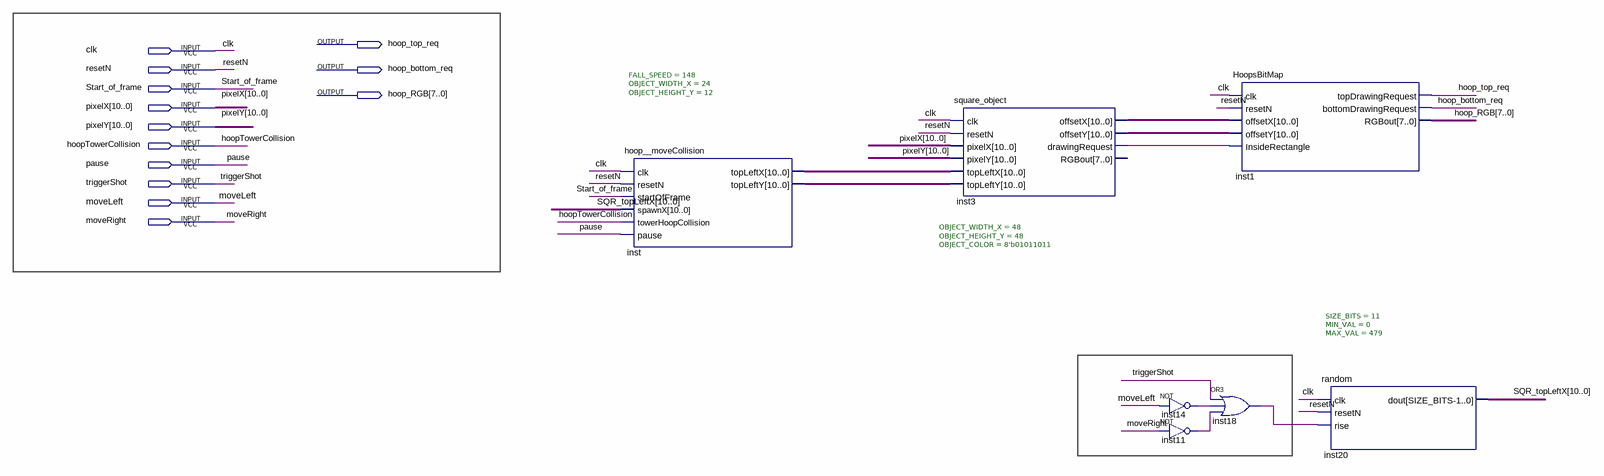
[diagram p0: schematic sheet]
// Quartus schematic TOP_HOOP.bdf as structural Verilog: 7 symbols, 13 pins
module TOP_HOOP (
  input  clk,
  input  resetN,
  input  Start_of_frame,
  input  [10:0] pixelX,
  input  [10:0] pixelY,
  input  hoopTowerCollision,
  input  pause,
  input  triggerShot,
  input  moveLeft,
  input  moveRight,
  output hoop_top_req,
  output hoop_bottom_req,
  output [7:0] hoop_RGB
);

  wire inst3_drawingrequest, inst11_out, inst14_out, inst18_out;
  wire [10:0] inst3_offsetx, inst3_offsety, inst_topleftx, inst_toplefty, SQR_topLeftX;

  hoop__moveCollision #(.FALL_SPEED(148), .OBJECT_WIDTH_X(24), .OBJECT_HEIGHT_Y(12)) inst (
    .clk(clk), .resetN(resetN), .startOfFrame(Start_of_frame), .spawnX(SQR_topLeftX),
    .towerHoopCollision(hoopTowerCollision), .pause(pause), .topLeftX(inst_topleftx), .topLeftY(inst_toplefty));
  square_object #(.OBJECT_WIDTH_X(48), .OBJECT_HEIGHT_Y(48), .OBJECT_COLOR(8'b01011011)) inst3 (
    .clk(clk), .resetN(resetN), .pixelX(pixelX), .pixelY(pixelY), .topLeftX(inst_topleftx),
    .topLeftY(inst_toplefty), .offsetX(inst3_offsetx), .offsetY(inst3_offsety),
    .drawingRequest(inst3_drawingrequest));  // open: RGBout
  not inst14 (inst14_out, moveLeft);
  not inst11 (inst11_out, moveRight);
  HoopsBitMap inst1 (
    .clk(clk), .resetN(resetN), .offsetX(inst3_offsetx), .offsetY(inst3_offsety),
    .InsideRectangle(inst3_drawingrequest), .topDrawingRequest(hoop_top_req),
    .bottomDrawingRequest(hoop_bottom_req), .RGBout(hoop_RGB));
  or inst18 (inst18_out, triggerShot, inst14_out, inst11_out);
  random #(.SIZE_BITS(11), .MIN_VAL(0), .MAX_VAL(479)) inst20 (
    .clk(clk), .resetN(resetN), .rise(inst18_out), .dout(SQR_topLeftX));
endmodule
